# EAGLE design neRecv (EAGLE 5.11)
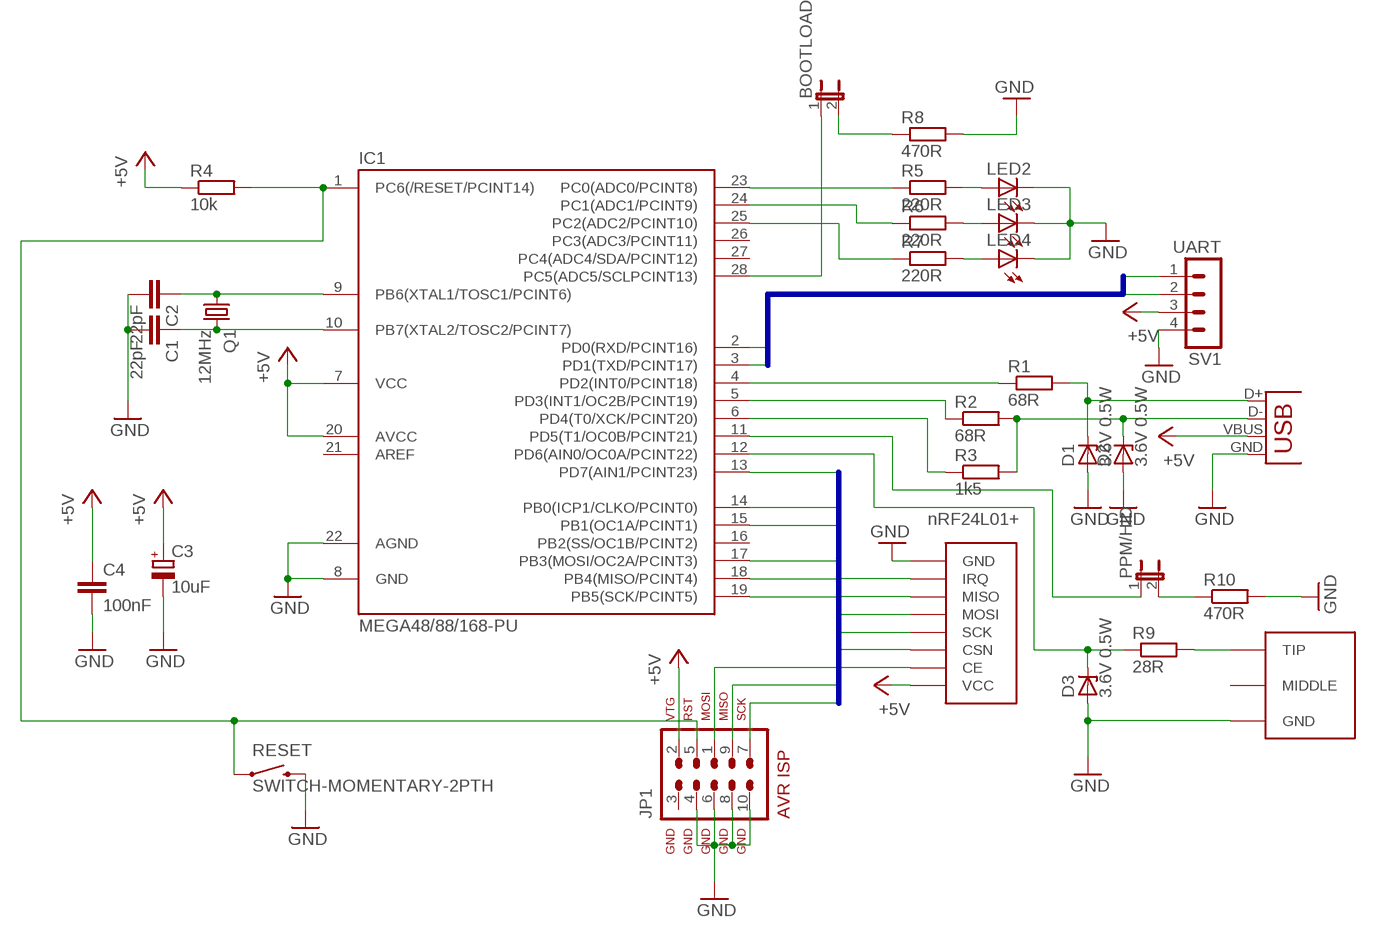
[diagram p0: schematic, sheet 1]

## Parts
BOOTLOAD  JP1E  [JP1]
C1  22pF  CAPACITOR050-024X044  [C050-024X044]
C2  22pF  CAPACITOR050-024X044  [C050-024X044]
C3  10uF  CAPACITOR-POLARE2,5-5  [E2,5-5]
C4  100nF  CAPACITOR025-025X050  [C025-025X050]
D1  3.6V 0.5W  ZENER-DIODEDO34-7  [DO34Z7]
D2  3.6V 0.5W  ZENER-DIODEDO34-7  [DO34Z7]
D3  3.6V 0.5W  ZENER-DIODEDO34-7  [DO34Z7]
IC1  MEGA48/88/168-PU  [DIL28-3]
JP1  AVR-ISP-10  [AVR-ISP-10]
LED2  LED3MM  [LED3MM]
LED3  LED3MM  [LED3MM]
LED4  LED3MM  [LED3MM]
PPM/HID  JP1E  [JP1]
PPM_OUT  JACK_FEMALE_3.5MMBLACK  [JACK_FEMALE_3.5MM_BLACK]
Q1  12MHz  CRYSTALHC49U-V  [HC49U-V]
R1  68R  RESISTOR0207/10  [0207/10]
R2  68R  RESISTOR0207/10  [0207/10]
R3  1k5  RESISTOR0207/10  [0207/10]
R4  10k  RESISTOR0207/10  [0207/10]
R5  220R  RESISTOR0207/10  [0207/10]
R6  220R  RESISTOR0207/10  [0207/10]
R7  220R  RESISTOR0207/10  [0207/10]
R8  470R  RESISTOR0207/10  [0207/10]
R9  28R  RESISTOR0207/10  [0207/10]
R10  470R  RESISTOR0207/10  [0207/10]
RESET  SWITCH-MOMENTARY-2PTH  [TACTILE-PTH]
SV1  UART  MA04-1  [MA04-1]
U$1  NRF24L01_MOD  [NRF24L01_MOD]
X1  USBPTH  [USB-B-PTH]

## Nets
+5V: C3.+ C4.1 IC1.7(VCC) IC1.20(AVCC) JP1.2 R4.1 SV1.3 U$1.VCC X1.VBUS
CE: IC1.14(PB0(ICP1/CLKO/PCINT0)) U$1.CE
CSN: IC1.15(PB1(OC1A/PCINT1)) U$1.CSN
D+: D1.C R1.2 X1.D+
D-: D2.C R2.2 R3.2 X1.D-
GND: C1.2 C2.2 C3.- C4.2 D1.A D2.A D3.A IC1.8(GND) IC1.22(AGND) JP1.4 JP1.6 JP1.8 JP1.10 LED2.K(C) LED3.K(C) LED4.K(C) PPM_OUT.GND R8.2 R10.2 RESET.3 SV1.4 U$1.GND X1.GND
INT0: IC1.4(PD2(INT0/PCINT18)) R1.1
IRQ: IC1.13(PD7(AIN1/PCINT23)) U$1.IRQ
MISO: IC1.18(PB4(MISO/PCINT4)) JP1.9 U$1.MISO
MOSI: IC1.17(PB3(MOSI/OC2A/PCINT3)) JP1.1 U$1.MOSI
N$1: BOOTLOAD.2 R8.1
N$2: D3.C IC1.12(PD6(AIN0/OC0A/PCINT22)) R9.1
N$3: PPM_OUT.TIP R9.2
N$4: IC1.11(PD5(T1/OC0B/PCINT21)) PPM/HID.1
N$5: PPM/HID.2 R10.1
N$6: IC1.5(PD3(INT1/OC2B/PCINT19)) R2.1
N$7: IC1.6(PD4(T0/XCK/PCINT20)) R3.1
N$8: IC1.25(PC2(ADC2/PCINT10)) R7.1
N$9: IC1.24(PC1(ADC1/PCINT9)) R6.1
N$12: LED2.A R5.2
N$15: LED3.A R6.2
N$16: LED4.A R7.2
N$17: IC1.23(PC0(ADC0/PCINT8)) R5.1
N$18: BOOTLOAD.1 IC1.28(PC5(ADC5/SCLPCINT13))
RESET: IC1.1(PC6(/RESET/PCINT14)) JP1.5 R4.2 RESET.1
RX: IC1.2(PD0(RXD/PCINT16)) SV1.1
SCK: IC1.19(PB5(SCK/PCINT5)) JP1.7 U$1.SCK
TX: IC1.3(PD1(TXD/PCINT17)) SV1.2
XTAL1: C2.1 IC1.9(PB6(XTAL1/TOSC1/PCINT6)) Q1.1
XTAL2: C1.1 IC1.10(PB7(XTAL2/TOSC2/PCINT7)) Q1.2
Unconnected: IC1.16(PB2(SS/OC1B/PCINT2)) IC1.21(AREF) IC1.26(PC3(ADC3/PCINT11)) IC1.27(PC4(ADC4/SDA/PCINT12)) JP1.3 PPM_OUT.MIDDLE

## Buses
RX,TX
IRQ,MISO,MOSI,SCK,CSN,CE

## Library data of the parts
BOOTLOAD PPM/HID = jumper:JP1E: JUMPER
C1 C2 C4 = KileParts:CAPACITOR: CAPACITOR, European symbol
C3 = KileParts:CAPACITOR-POLAR: POLARIZED CAPACITOR, European symbol
D1-D3 = diode:ZENER-DIODE: Z-Diode
IC1 = avr-4:MEGA48/88/168-PU
JP1 = KileParts:AVR-ISP-10: AVR ISP-10 Serial Programming Header
LED2-LED4 = KileParts:LED: LED OSRAM: - CHIPLED LG R971, LG N971, LY N971, LG Q971, LY Q971, LO R971, LY R971 LH N974, LH R974 LS Q976, LO Q976, LY Q976 LO Q996 - Hyper CHIPLED LW Q18S LB Q993, LB Q99A, LB R99A - SideLED LS A670, LO A670, LY A670, LG A670, LP A670 LB A673, LV A673, LT A673, LW A673 LH A674 LY A675 LS A676, LA A676, LO A676, LY A676, LW A676 LS A679, LY A679, LG A679 - Hyper Micro SIDELED® LS Y876, LA Y876, LO Y876, LY Y876 LT Y87S - SmartLED LW L88C, LW L88S LB L89C, LB L89S, LG L890 LS L89K, LO L89K, LY L89K LS L896, LA L896, LO L896, LY L896 - TOPLED LS T670, LO T670, LY T670, LG T670, LP T670 LSG T670, LSP T670, LSY T670, LOP T670, LYG T670 LG T671, LOG T671, LSG T671 LB T673, LV T673, LT T673, LW T673 LH T674 LS T676, LA T676, LO T676, LY T676, LB T676, LH T676, LSB T676, LW T676 LB T67C, LV T67C, LT T67C, LS T67K, LO T67K, LY T67K, LW E67C LS E67B, LA E67B, LO E67B, LY E67B, LB E67C, LV E67C, LT E67C LW T67C LS T679, LY T679, LG T679 LS T770, LO T770, LY T770, LG T770, LP T770 LB T773, LV T773, LT T773, LW T773 LH T774 LS E675, LA E675, LY E675, LS T675 LS T776, LA T776, LO T776, LY T776, LB T776 LHGB T686 LT T68C, LB T68C - Hyper Mini TOPLED® LB M676 - Mini TOPLED Santana® LG M470 LS M47K, LO M47K, LY M47K Source: http://www.osram.convergy.de LUXEON: - LUMILED® LXK2-PW12-R00, LXK2-PW12-S00, LXK2-PW14-U00, LXK2-PW14-V00 LXK2-PM12-R00, LXK2-PM12-S00, LXK2-PM14-U00 LXK2-PE12-Q00, LXK2-PE12-R00, LXK2-PE12-S00, LXK2-PE14-T00, LXK2-PE14-U00 LXK2-PB12-K00, LXK2-PB12-L00, LXK2-PB12-M00, LXK2-PB14-N00, LXK2-PB14-P00, LXK2-PB14-Q00 LXK2-PR12-L00, LXK2-PR12-M00, LXK2-PR14-Q00, LXK2-PR14-R00 LXK2-PD12-Q00, LXK2-PD12-R00, LXK2-PD12-S00 LXK2-PH12-R00, LXK2-PH12-S00 LXK2-PL12-P00, LXK2-PL12-Q00, LXK2-PL12-R00 Source: www.luxeon.com KINGBRIGHT: KA-3528ASYC Source: www.kingbright.com
PPM_OUT = KileParts:JACK_FEMALE_3.5MM
Q1 = KileParts:CRYSTAL: CRYSTAL; OC_FARNELL: 1666969; OC_NEWARK: unknown
R1-R10 = KileParts:RESISTOR: RESISTOR, European symbol
RESET = SparkFun:SWITCH-MOMENTARY-2
SV1 = con-lstb:MA04-1: PIN HEADER; OC_FARNELL: unknown; OC_NEWARK: unknown
U$1 = KileParts:NRF24L01_MOD: This is the pinout of the nRF24L01+ board from SparkFun.
X1 = SparkFun:USB: USB Connectors USB-B-PTH is fully proven SKU : PRT-00139 USB-miniB is fully proven SKU : PRT-00587 USB-A-PCB is untested. USB-A-H is throughly reviewed, but untested. Spark Fun Electronics SKU : PRT-00437 USB-B-SMT is throughly reviewed, but untested. Needs silkscreen touching up. USB-A-S has not been used/tested USB-MB-H has not been used/tested

## Board
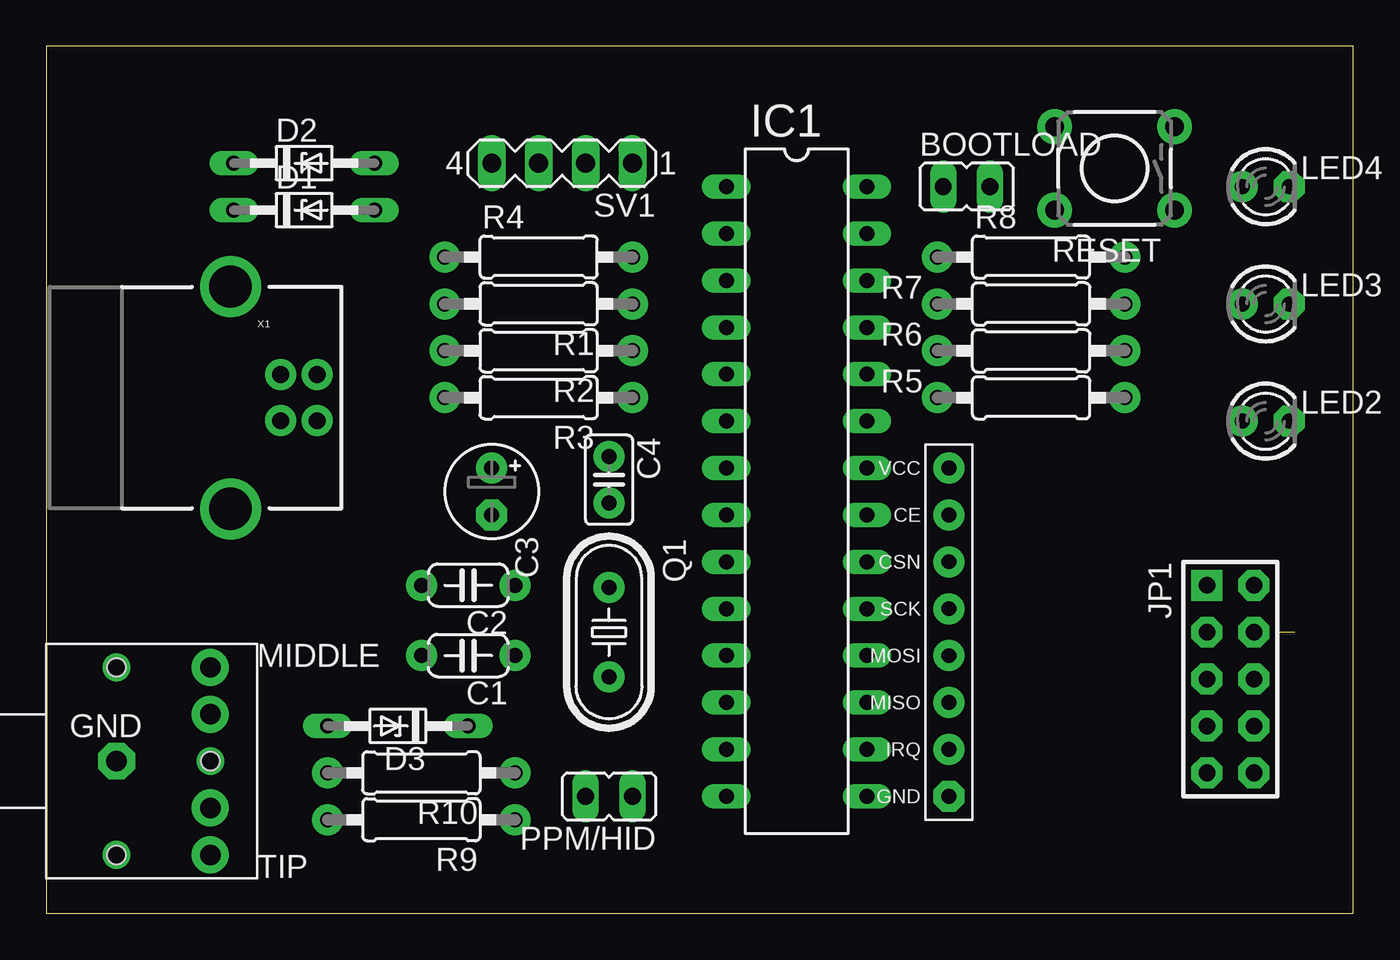
[diagram p1: board, top side]
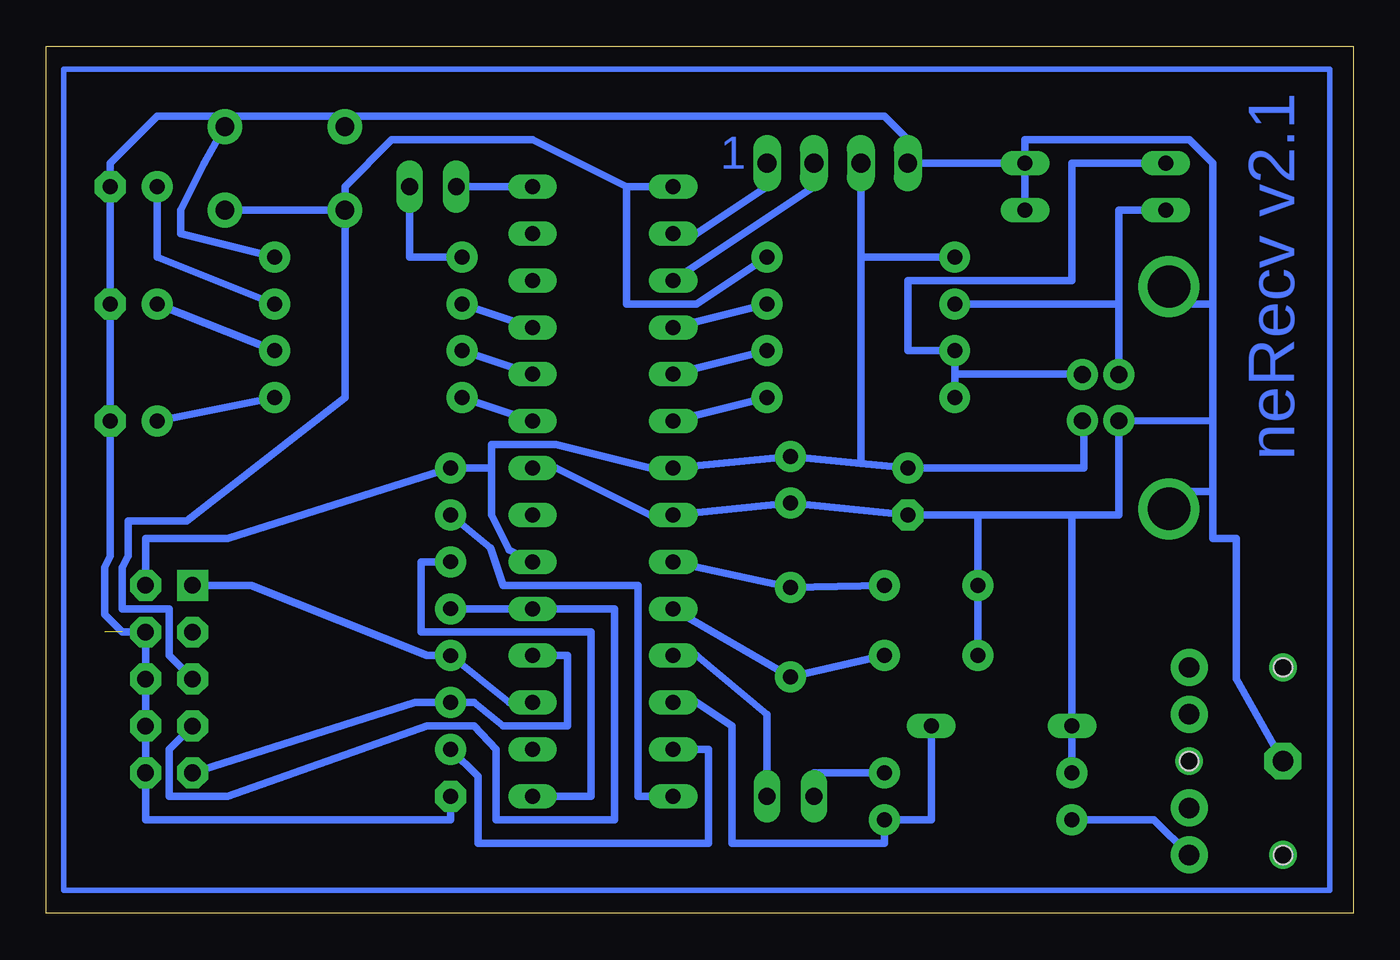
[diagram p2: board, bottom side, seen from below]

Size 70.79 x 46.98 mm. Coordinates in mm from the lower left corner, seen from the top.
Outline: 0,0 70.79,0 70.79,46.98 0,46.98 0,0
Copper layers (1*16): Top 0.035mm / dielectric 1.5mm / Bottom 0.035mm
Design rules "default *": minimum track width 10mil, minimum drill 24mil, track to track 8mil, track to pad 8mil, pad to pad 8mil, via to via 8mil, smd to smd 8mil, copper to edge 40mil, drill to drill 8mil, minimum pad ring 10mil, minimum via ring 8mil, stop-mask expansion 4mil, vias tented up to drill 0mil, thermal gap 10mil

### Footprints (pad centres in the part's own frame; a part is rotated, then mirrored left to right if it is on the bottom)
JP1 = drill 0.914 long: 1 0,-1.27; 2 0,1.27
C050-024X044 = drill 0.813 pad 1.676 round: 1 -2.54,0; 2 2.54,0
E2,5-5 = drill 0.813 pad 1.676 round: + -1.27,0 | drill 0.813 pad 1.676 octagon: - 1.27,0
C025-025X050 = drill 0.813 pad 1.676 round: 1 -1.27,0; 2 1.27,0
DO34Z7 = drill 0.813 long: A 3.81,0; C -3.81,0
DIL28-3 = drill 0.813 long: 1 -16.51,-3.81; 2 -13.97,-3.81; 3 -11.43,-3.81; 4 -8.89,-3.81; 5 -6.35,-3.81; 6 -3.81,-3.81; 7 -1.27,-3.81; 8 1.27,-3.81; 9 3.81,-3.81; 10 6.35,-3.81; 11 8.89,-3.81; 12 11.43,-3.81; 13 13.97,-3.81; 14 16.51,-3.81; 15 16.51,3.81; 16 13.97,3.81; 17 11.43,3.81; 18 8.89,3.81; 19 6.35,3.81; 20 3.81,3.81; 21 1.27,3.81; 22 -1.27,3.81; 23 -3.81,3.81; 24 -6.35,3.81; 25 -8.89,3.81; 26 -11.43,3.81; 27 -13.97,3.81; 28 -16.51,3.81
AVR-ISP-10 = drill 0.9 pad 1.676 square: 1 -5.08,-1.27 | drill 0.9 pad 1.676 octagon: 2 -5.08,1.27; 3 -2.54,-1.27; 4 -2.54,1.27; 5 0,-1.27; 6 0,1.27; 7 2.54,-1.27; 8 2.54,1.27; 9 5.08,-1.27; 10 5.08,1.27
LED3MM = drill 0.813 pad 1.676 round: A -1.27,0 | drill 0.813 pad 1.676 octagon: K 1.27,0
JACK_FEMALE_3.5MM_BLACK = drill 1.1 pad 2 octagon: GND -2.54,0 | drill 1.1 pad 2 round: MIDDLE 2.54,5.08; NC1 2.54,-2.54; NC2 2.54,2.54; TIP 2.54,-5.08 | hole 1: -2.54,-5.08; -2.54,5.08; 2.54,0
HC49U-V = drill 0.813 pad 1.676 round: 1 -2.413,0; 2 2.413,0
0207/10 = drill 0.813 pad 1.676 round: 1 -5.08,0; 2 5.08,0
TACTILE-PTH = drill 1.016 pad 1.88 round: 1 -3.251,2.261; 2 3.251,2.261; 3 -3.251,-2.261; 4 3.251,-2.261
MA04-1 = drill 1.016 long: 1 -3.81,0; 2 -1.27,0; 3 1.27,0; 4 3.81,0
NRF24L01_MOD = drill 0.8 pad 1.676 round: CE 0,-5.08; CSN 0,-2.54; IRQ 0,7.62; MISO 0,5.08; MOSI 0,2.54; SCK 0,0; VCC 0,-7.62 | drill 0.8 pad 1.676 octagon: GND 0,10.16
USB-B-PTH = drill 0.914 pad 1.676 round: D+ 0,1.25; D- 1.981,1.25; GND 0,-1.25; VBUS 1.981,-1.25 | drill 2.286 round: S1 -2.718,-6.02; S2 -2.718,6.02

### Placement (x,y rotation side)
BOOTLOAD  49.85,39.37 270 top
C1  22.86,13.97 180 top
C2  22.86,17.78 180 top
C3  24.13,22.86 270 top
C4  30.48,23.49 270 top
D1  13.97,38.1 0 top
D2  13.97,40.64 0 top
D3  19.05,10.16 180 top
IC1  40.64,22.86 270 top
JP1  64.14,12.7 270 top
LED2  66.04,26.67 0 top
LED3  66.04,33.02 0 top
LED4  66.04,39.37 0 top
PPM/HID  30.48,6.35 90 top
PPM_OUT  6.35,8.26 0 top
Q1  30.48,15.24 270 top
R1  26.67,33.02 180 top
R2  26.67,30.48 180 top
R3  26.67,27.94 180 top
R4  26.67,35.56 0 top
R5  53.34,27.94 0 top
R6  53.34,30.48 0 top
R7  53.34,33.02 0 top
R8  53.34,35.56 0 top
R9  20.32,5.08 180 top
R10  20.32,7.62 180 top
RESET  57.86,40.36 180 top
SV1  27.94,40.64 180 top
U$1  48.9,16.51 180 top
X1  12.7,27.94 0 top

### Tracks (layer width: path | path; a pad name or v marks a point on that pad's centre or on a via)
+5V
  Bottom 0.406: 46.67,24.13 U$1.VCC 60.96,20.32 65.41,20.32 JP1.2 | 46.67,24.13 46.67,21.59 45.72,19.68 IC1.20 | 46.67,24.13 46.67,25.4 43.18,25.4 38.1,24.13 IC1.7 C4.1 26.68,24.38 | X1.VBUS 14.6,26.69 14.6,24.13 C3.+ 26.68,24.38 | 26.68,24.38 26.67,35.56 | 26.67,35.56 SV1.3 | 26.67,35.56 R4.1
CE
  Bottom 0.406: IC1.14 38.73,6.35 38.73,17.78 46.04,17.78 46.74,19.81 U$1.CE
CSN
  Bottom 0.406: IC1.15 41.27,6.35 41.27,15.24 50.48,15.24 50.48,19.05 U$1.CSN
D+
  Bottom 0.406: X1.D+ 12.7,33.02 | 12.7,33.02 R1.2 | D1.C 12.7,38.1 12.7,33.02
D-
  Bottom 0.406: 21.59,29.21 R3.2 | 21.59,29.21 R2.2 24.13,30.48 24.13,34.29 15.24,34.29 15.24,40.64 D2.C | X1.D- 14.92,29.21 21.59,29.21
GND  (1 unrouted)
  Bottom 0.406: D2.A 17.78,41.91 8.89,41.91 7.62,40.64 7.62,33.02 | D2.A D1.A | IC1.22 43.18,24.13 38.1,21.59 IC1.8 C4.2 C3.- 20.32,21.59 | 7.62,26.67 X1.GND 12.7,21.59 15.24,21.59 | 7.62,26.67 7.62,33.02 | 15.24,21.59 20.32,21.59 | 20.32,21.59 C2.2 C1.2 | D2.A SV1.4 24.13,41.91 25.4,43.18 60.96,43.18 | PPM_OUT.GND 6.35,12.7 6.35,20.32 7.62,20.32 7.62,22.86 | 7.62,22.86 7.62,26.67 | R10.2 D3.A 15.24,21.59 | R8.2 63.5,36.83 63.5,38.1 62.23,40.64 RESET.3 60.96,43.18 | 60.96,43.18 64.77,43.18 67.31,40.64 LED4.K LED3.K LED2.K 67.31,19.37 67.63,18.73 67.63,16.19 66.67,15.24 JP1.4 JP1.6 JP1.8 JP1.10 65.41,5.08 48.9,5.08 U$1.GND | 7.62,33.02 8.89,33.02 | 7.62,22.86 8.89,22.86
INT0
  Bottom 0.406: R1.1 IC1.4
IRQ
  Bottom 0.406: IC1.13 34.93,8.89 34.93,3.81 47.4,3.81 47.4,7.43 U$1.IRQ
MISO
  Bottom 0.406: IC1.18 42.55,13.97 42.55,10.16 46.04,10.16 47.62,11.43 U$1.MISO 50.8,11.43 JP1.9
MOSI
  Bottom 0.406: IC1.17 45.72,11.43 U$1.MOSI 50.16,13.97 59.69,17.78 JP1.1
N$1
  Bottom 0.406: BOOTLOAD.2 51.12,35.56 R8.1
N$2
  Bottom 0.406: IC1.12 35.56,11.43 33.66,10.16 33.66,3.81 25.4,3.81 R9.1 22.86,5.08 D3.C
N$3
  Bottom 0.406: R9.2 10.79,5.08 PPM_OUT.TIP
N$4
  Bottom 0.406: IC1.11 35.56,13.97 31.75,10.79 PPM/HID.1
N$5
  Bottom 0.406: R10.1 29.21,7.62 PPM/HID.2
N$6
  Bottom 0.406: R2.1 IC1.5
N$7
  Bottom 0.406: R3.1 IC1.6
N$8
  Bottom 0.406: IC1.25 R7.1
N$9
  Bottom 0.406: IC1.24 R6.1
N$10
  Bottom 0.305: 1.27,3.81 1.27,45.72 3.81,45.72
N$11  (via drill 1 pad 1.5)
  other vias: 8.89,8.26
N$12
  Bottom 0.406: R5.2 LED2.A
N$13  (via drill 1 pad 1.5)
  other vias: 3.81,3.17
N$14  (via drill 1 pad 1.5)
  other vias: 3.81,13.33
N$15
  Bottom 0.406: R6.2 LED3.A
N$16
  Bottom 0.406: R7.2 64.77,35.56 LED4.A
N$17
  Bottom 0.406: IC1.23 R5.1
N$18
  Bottom 0.406: IC1.28 BOOTLOAD.1
N$19
  Bottom 0.305: 3.81,45.72 69.85,45.72 69.85,41.91
N$23
  Bottom 0.305: 69.85,41.91 69.85,1.27 67.31,1.27
N$26
  Bottom 0.305: 1.27,3.81 1.27,1.27 67.31,1.27
RESET
  Bottom 0.406: 39.37,39.37 39.37,33.02 35.56,33.02 R4.2 | 39.37,39.37 IC1.1 | 39.37,39.37 44.45,41.91 52.07,41.91 54.61,39.37 54.61,38.1 | JP1.5 64.14,13.97 64.14,16.51 66.67,16.51 66.67,18.73 66.36,19.37 66.36,21.27 63.18,21.27 54.61,27.94 54.61,38.1 | 54.61,38.1 RESET.1
RX
  Bottom 0.406: IC1.2 35.56,36.83 31.75,39.37 SV1.1
SCK
  Bottom 0.406: JP1.7 64.14,8.89 64.14,6.35 60.96,6.35 50.16,10.16 47.62,10.16 46.42,8.89 46.42,5.08 40.01,5.08 40.01,16.51 IC1.19 U$1.SCK
TX
  Bottom 0.406: SV1.2 29.21,39.37 IC1.3
XTAL1
  Bottom 0.406: C2.1 Q1.1 IC1.9
XTAL2
  Bottom 0.406: IC1.10 Q1.2 C1.1

### Text on the board
Bottom: neRecv v2.1 | 1